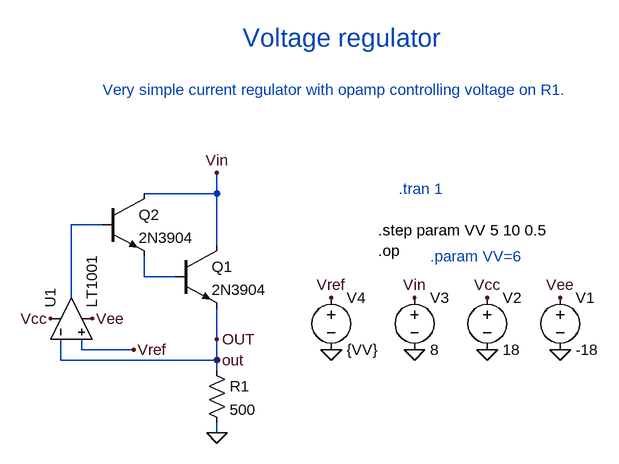
[diagram p0: schematic Voltage-regulator-npn.asc]
Voltage-regulator-npn.asc, the LTspice schematic file:
Version 4.1
SHEET 1 1056 680
WIRE 160 112 160 80
WIRE 160 112 48 112
WIRE -16 160 -64 160
WIRE 160 192 160 112
WIRE 48 240 48 208
WIRE 96 240 48 240
WIRE -64 272 -64 160
WIRE 160 336 160 288
WIRE -48 352 -48 336
WIRE 32 352 -48 352
WIRE -80 368 -80 336
WIRE 160 368 160 336
WIRE 160 368 -80 368
WIRE 160 384 160 368
WIRE 160 480 160 464
FLAG 160 80 Vin
FLAG 576 352 0
FLAG 688 352 0
FLAG 464 352 0
FLAG 576 272 Vcc
FLAG -96 304 Vcc
FLAG 688 272 Vee
FLAG -32 304 Vee
FLAG 160 480 0
FLAG 336 352 0
FLAG 32 352 Vref
FLAG 336 272 Vref
FLAG 464 272 Vin
FLAG 160 336 OUT
FLAG 160 368 out
SYMBOL npn 96 192 R0
SYMATTR InstName Q1
SYMATTR Value 2N3904
SYMBOL npn -16 112 R0
SYMATTR InstName Q2
SYMATTR Value 2N3904
SYMBOL Opamps\\LT1001 -128 304 R270
SYMATTR InstName U1
SYMBOL voltage 688 256 R0
WINDOW 123 0 0 Left 2
WINDOW 39 0 0 Left 2
SYMATTR InstName V1
SYMATTR Value -18
SYMBOL voltage 576 256 R0
WINDOW 123 0 0 Left 2
WINDOW 39 0 0 Left 2
SYMATTR InstName V2
SYMATTR Value 18
SYMBOL voltage 464 256 R0
WINDOW 123 0 0 Left 2
WINDOW 39 0 0 Left 2
SYMATTR InstName V3
SYMATTR Value 8
SYMBOL res 144 368 R0
SYMATTR InstName R1
SYMATTR Value 500
SYMBOL voltage 336 256 R0
WINDOW 123 0 0 Left 2
WINDOW 39 0 0 Left 2
SYMATTR InstName V4
SYMATTR Value {VV}
TEXT 408 168 Left 2 !.step param VV 5 10 0.5
TEXT 408 200 Left 2 !.op
TEXT -16 -48 Left 2 ;Very simple current regulator with opamp controlling voltage on R1.
TEXT 200 -128 Left 4 ;Voltage regulator
TEXT 488 208 Left 2 ;.param VV=6
TEXT 440 104 Left 2 ;.tran 1

The netlist it stands for:
* Voltage-regulator-npn.asc
Q1 Vin N002 OUT 0 2N3904
Q2 Vin N001 N002 0 2N3904
X§U1 Vref OUT Vcc Vee N001 LT1001  ; pins In+ In- V+ V- OUT
V1 Vee 0 -18
V2 Vcc 0 18
V3 Vin 0 8
R1 OUT 0 500
V4 Vref 0 {VV}
.model NPN NPN
.model PNP PNP
.lib standard.bjt
.step param VV 5 10 0.5
.op
* Very simple current regulator with opamp controlling voltage on R1.
* Voltage regulator
* .param VV=6
* .tran 1
.lib LTC.lib
.backanno
.end